# EAGLE design TRANSISTOR_LADDER_VCF_CORE_BC847BS (EAGLE 7.5.0)
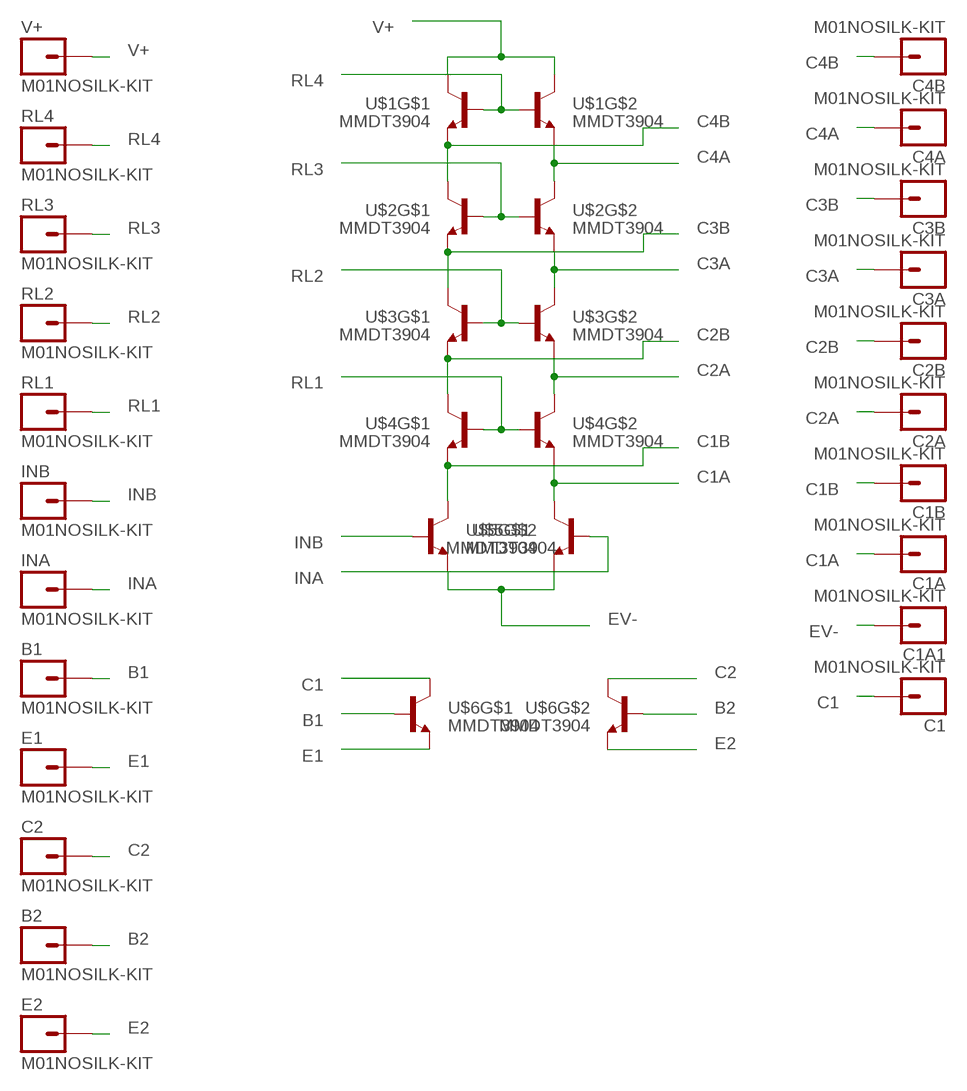
[diagram p0: schematic, sheet 1]

## Parts
B1  M01NOSILK-KIT  [1X01NS-KIT]
B2  M01NOSILK-KIT  [1X01NS-KIT]
C1  M01NOSILK-KIT  [1X01NS-KIT]
C1A  M01NOSILK-KIT  [1X01NS-KIT]
C1A1  M01NOSILK-KIT  [1X01NS-KIT]
C1B  M01NOSILK-KIT  [1X01NS-KIT]
C2  M01NOSILK-KIT  [1X01NS-KIT]
C2A  M01NOSILK-KIT  [1X01NS-KIT]
C2B  M01NOSILK-KIT  [1X01NS-KIT]
C3A  M01NOSILK-KIT  [1X01NS-KIT]
C3B  M01NOSILK-KIT  [1X01NS-KIT]
C4A  M01NOSILK-KIT  [1X01NS-KIT]
C4B  M01NOSILK-KIT  [1X01NS-KIT]
E1  M01NOSILK-KIT  [1X01NS-KIT]
E2  M01NOSILK-KIT  [1X01NS-KIT]
INA  M01NOSILK-KIT  [1X01NS-KIT]
INB  M01NOSILK-KIT  [1X01NS-KIT]
RL1  M01NOSILK-KIT  [1X01NS-KIT]
RL2  M01NOSILK-KIT  [1X01NS-KIT]
RL3  M01NOSILK-KIT  [1X01NS-KIT]
RL4  M01NOSILK-KIT  [1X01NS-KIT]
U$1  MMDT3904  [SOT363]
U$2  MMDT3904  [SOT363]
U$3  MMDT3904  [SOT363]
U$4  MMDT3904  [SOT363]
U$5  MMDT3904  [SOT363]
U$6  MMDT3904  TRANSISTOR_NPN2UPMMDT3904  [SOT363]
V+  M01NOSILK-KIT  [1X01NS-KIT]

## Nets
B1: B1.1 U$6.2(B)
B2: B2.1 U$6.5(B)
C1: C1.1 U$6.6(C)
C1A: C1A.1 U$4.1(E) U$5.6(C)
C1B: C1B.1 U$4.4(E) U$5.3(C)
C2: C2.1 U$6.3(C)
C2A: C2A.1 U$3.1(E) U$4.6(C)
C2B: C2B.1 U$3.4(E) U$4.3(C)
C3A: C3A.1 U$2.1(E) U$3.6(C)
C3B: C3B.1 U$2.4(E) U$3.3(C)
C4A: C4A.1 U$1.1(E) U$2.6(C)
C4B: C4B.1 U$1.4(E) U$2.3(C)
E1: E1.1 U$6.1(E)
E2: E2.1 U$6.4(E)
EV-: C1A1.1 U$5.1(E) U$5.4(E)
INA: INA.1 U$5.2(B)
INB: INB.1 U$5.5(B)
RL1: RL1.1 U$4.2(B) U$4.5(B)
RL2: RL2.1 U$3.2(B) U$3.5(B)
RL3: RL3.1 U$2.2(B) U$2.5(B)
RL4: RL4.1 U$1.2(B) U$1.5(B)
V+: U$1.3(C) U$1.6(C) V+.1

## Notes on the sheet
- V+
- V+ | C4B
- RL4
- C4B | C4A
- RL4
- RL3 | C4A
- C3B
- RL3 | C3B
- RL2 | C3A | C3A
- RL2
- C2B | C2B
- RL1 | C2A
- RL1 | C2A
- C1B
- C1A | C1B
- INB
- INB
- C1A
- INA
- INA
- EV- | EV-
- B1 | C1 | C2
- C1
- B1 | B2
- E1 | E2
- E1
- C2
- B2
- E2

## Library data of the parts
B1 B2 C1 C1A C1A1 C1B C2 C2A C2B C3A C3B C4A C4B E1 E2 INA INB RL1-RL4 V+ = SparkFun-Connectors:M01: Header 1 Standard 1-pin 0.1" header. Use with straight break away headers (SKU : PRT-00116), right angle break away headers (PRT-00553), swiss pins (PRT-00743), machine pins (PRT-00117), and female headers (PRT-00115).
U$1-U$5 = SparkFun-DiscreteSemi:MMDT3904: Dual NPN transistor
U$6 = SparkFun-DiscreteSemi:TRANSISTOR_NPN2UP: 2-up package of NPN transistors MMDT3904- TRANS-09373 (SOT-363, 200mA 40V); PROD_ID: TRANS-09373

## Board
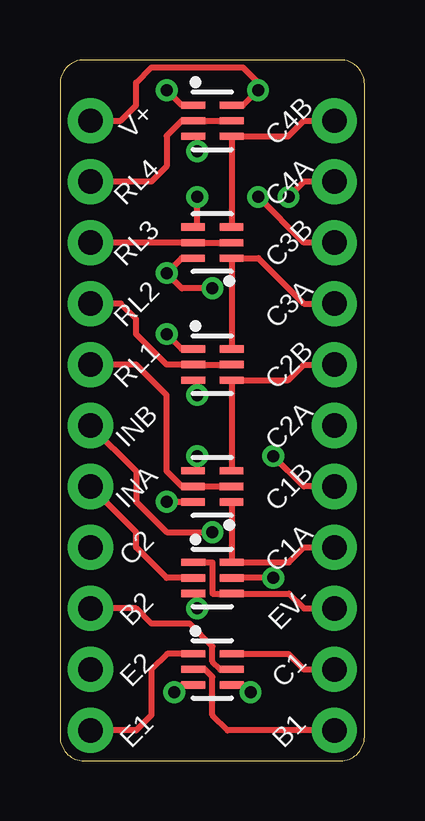
[diagram p1: board, top side]
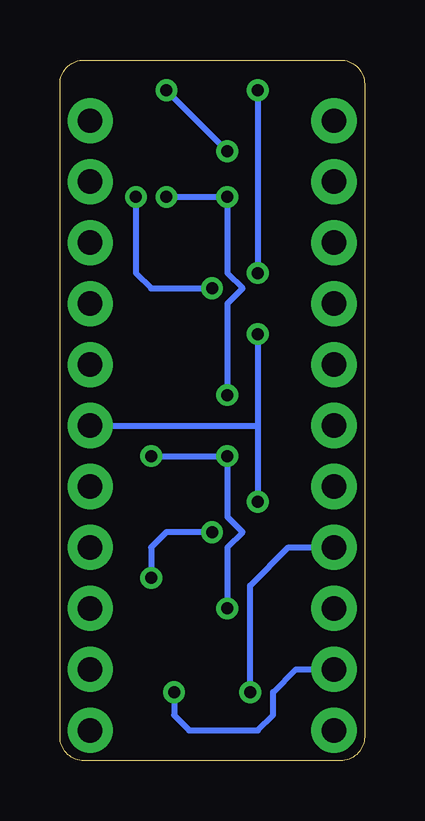
[diagram p2: board, bottom side, seen from below]

Size 12.69 x 29.2 mm. Coordinates in mm from the lower left corner, seen from the top.
Outline: 0,28.2 0,1 arc90 1,0 11.69,0 arc90 12.69,1 12.69,28.2 arc90 11.69,29.2 1,29.2 arc90 0,28.2
Copper layers (1*16): Top 0.035mm / dielectric 1.5mm / Bottom 0.035mm
Design rules "default": minimum track width 10mil, minimum drill 24mil, track to track 8mil, track to pad 8mil, pad to pad 8mil, via to via 8mil, smd to smd 8mil, copper to edge 40mil, drill to drill 8mil, minimum pad ring 10mil, minimum via ring 8mil, stop-mask expansion 4mil, vias tented up to drill 0mil, thermal gap 10mil

### Footprints (pad centres in the part's own frame; a part is rotated, then mirrored left to right if it is on the bottom)
1X01NS-KIT = drill 1.016 pad 1.88: 1 0,0
SOT363 = smd 0.3 x 0.99: 1 -0.65,-0.8; 2 0,-0.8; 3 0.65,-0.8; 4 0.65,0.81; 5 0,0.81; 6 -0.65,0.81

### Placement (x,y rotation side)
B1  11.43,1.27 0 top
B2  1.27,6.35 0 top
C1  11.43,3.81 0 top
C1A  11.43,8.89 0 top
C1A1  11.43,6.35 0 top
C1B  11.43,11.43 0 top
C2  1.27,8.89 0 top
C2A  11.43,13.97 0 top
C2B  11.43,16.51 0 top
C3A  11.43,19.05 0 top
C3B  11.43,21.59 0 top
C4A  11.43,24.13 0 top
C4B  11.43,26.67 0 top
E1  1.27,1.27 0 top
E2  1.27,3.81 0 top
INA  1.27,11.43 0 top
INB  1.27,13.97 0 top
RL1  1.27,16.51 0 top
RL2  1.27,19.05 0 top
RL3  1.27,21.59 0 top
RL4  1.27,24.13 0 top
U$1  6.35,26.67 270 top
U$2  6.35,21.59 90 top
U$3  6.35,16.51 270 top
U$4  6.35,11.43 90 top
U$5  6.35,7.62 270 top
U$6  6.35,3.81 270 top
V+  1.27,26.67 0 top

### Tracks (layer width: path | path; a pad name or v marks a point on that pad's centre or on a via)
B1
  Top 0.254: B1.1 6.99,1.27 6.35,1.91 6.35,3.49 6.03,3.81 U$6.2
B2
  Top 0.254: U$6.5 6.67,3.81 6.35,4.13 6.35,4.76 5.4,5.71 3.81,5.71 3.17,6.35 B2.1
C1
  Top 0.254: U$6.6 9.51,4.46 10.16,3.81 C1.1
C1A
  Top 0.254: U$4.1 U$5.6 9.54,8.27 10.16,8.89 C1A.1
C1B  (via drill 0.5)
  Top 0.254: U$4.4 5.71,12.06 v5.71,12.7 | v5.71,6.35 5.71,6.97 U$5.3 | C1B.1 10.16,11.43 v8.89,12.7
  Bottom 0.254: v5.71,6.35 5.71,8.89 5.08,9.53 5.71,10.16 v5.71,12.7 v8.89,12.7
C2  (via drill 0.5)
  Top 0.254: U$6.3 5.07,3.16 v4.76,2.86
  Bottom 0.254: v4.76,2.86 4.76,7.3 3.17,8.89 C2.1
C2A  (via drill 0.5)
  Top 0.254: U$3.1 5.07,17.16 v4.45,17.78 | v4.45,10.79 5.08,10.79 U$4.6
  Bottom 0.254: v4.45,17.78 4.45,13.97 | 4.45,13.97 v4.45,10.79 | C2A.1 4.45,13.97
C2B
  Top 0.254: U$4.3 U$3.4 9.51,15.86 10.16,16.51 C2B.1
C3A
  Top 0.254: U$3.6 U$2.1 8.27,20.94 10.16,19.05 C3A.1
C3B  (via drill 0.5)
  Top 0.254: U$2.4 5.71,22.24 v5.71,23.5 | v5.71,15.24 5.71,15.7 U$3.3 | C3B.1 10.16,21.59 v8.26,23.5
  Bottom 0.254: v5.71,15.24 5.71,19.05 5.08,19.68 5.71,20.32 v5.71,23.5 v8.26,23.5
C4A  (via drill 0.5)
  Top 0.254: U$1.1 5.07,27.32 v4.45,27.94 | U$2.6 5.07,20.94 v4.45,20.32 5.08,19.68 v6.35,19.68 | C4A.1 10.16,24.13 v9.53,23.5
  Bottom 0.254: v4.45,27.94 v4.45,20.32 | v9.53,23.5 9.53,20.32 8.89,19.68 v6.35,19.68
C4B
  Top 0.254: U$2.3 U$1.4 9.51,26.02 10.16,26.67 C4B.1
E1
  Top 0.254: U$6.1 4.46,4.46 3.81,3.81 3.81,1.91 3.17,1.27 E1.1
E2  (via drill 0.5)
  Top 0.254: U$6.4 7.63,3.16 v7.94,2.86
  Bottom 0.254: v7.94,2.86 7.94,1.91 7.3,1.27 4.45,1.27 3.81,1.91 3.81,2.86 2.86,3.81 E2.1
EV-
  Top 0.254: U$5.1 6.35,8.27 6.35,6.97 U$5.4 9.54,6.97 10.16,6.35 C1A1.1
INA
  Top 0.254: U$5.2 4.45,7.62 3.17,8.89 3.17,9.53 INA.1
INB  (via drill 0.5)
  Top 0.254: INB.1 3.17,12.06 3.17,10.79 4.45,9.53 v6.35,9.53 | v8.89,7.62 U$5.5
  Bottom 0.254: v6.35,9.53 8.26,9.53 8.89,8.89 v8.89,7.62
RL1
  Top 0.254: U$4.2 U$4.5 5.08,11.43 4.45,12.06 4.45,15.24 3.17,16.51 RL1.1
RL2
  Top 0.254: U$3.5 U$3.2 4.45,16.51 3.17,17.78 3.17,18.41 2.54,19.05 RL2.1
RL3
  Top 0.254: U$2.2 U$2.5 RL3.1
RL4
  Top 0.254: U$1.5 U$1.2 5.08,26.67 4.45,26.04 4.45,24.77 3.81,24.13 RL4.1
V+  (via drill 0.5)
  Top 0.254: U$1.3 5.55,26.04 5.71,26.04 v5.71,25.4 | U$1.6 6.99,27.32 6.99,27.3 7.62,27.3 v8.26,27.94 8.26,28.26 7.62,28.89 3.81,28.89 3.17,28.26 3.17,27.3 2.54,26.67 V+.1
  Bottom 0.254: v5.71,25.4 v8.26,27.94

### Text on the board
tNames: V+ | C4B | RL4 | C4A | RL3 | C3B | RL2 | C3A | RL1 | C2B | INB | C2A | INA | C1B | C2 | C1A | B2 | EV- | E2 | C1 | E1 | B1